# Altium project Assignment2.PrjPcb (part 1 of 2)
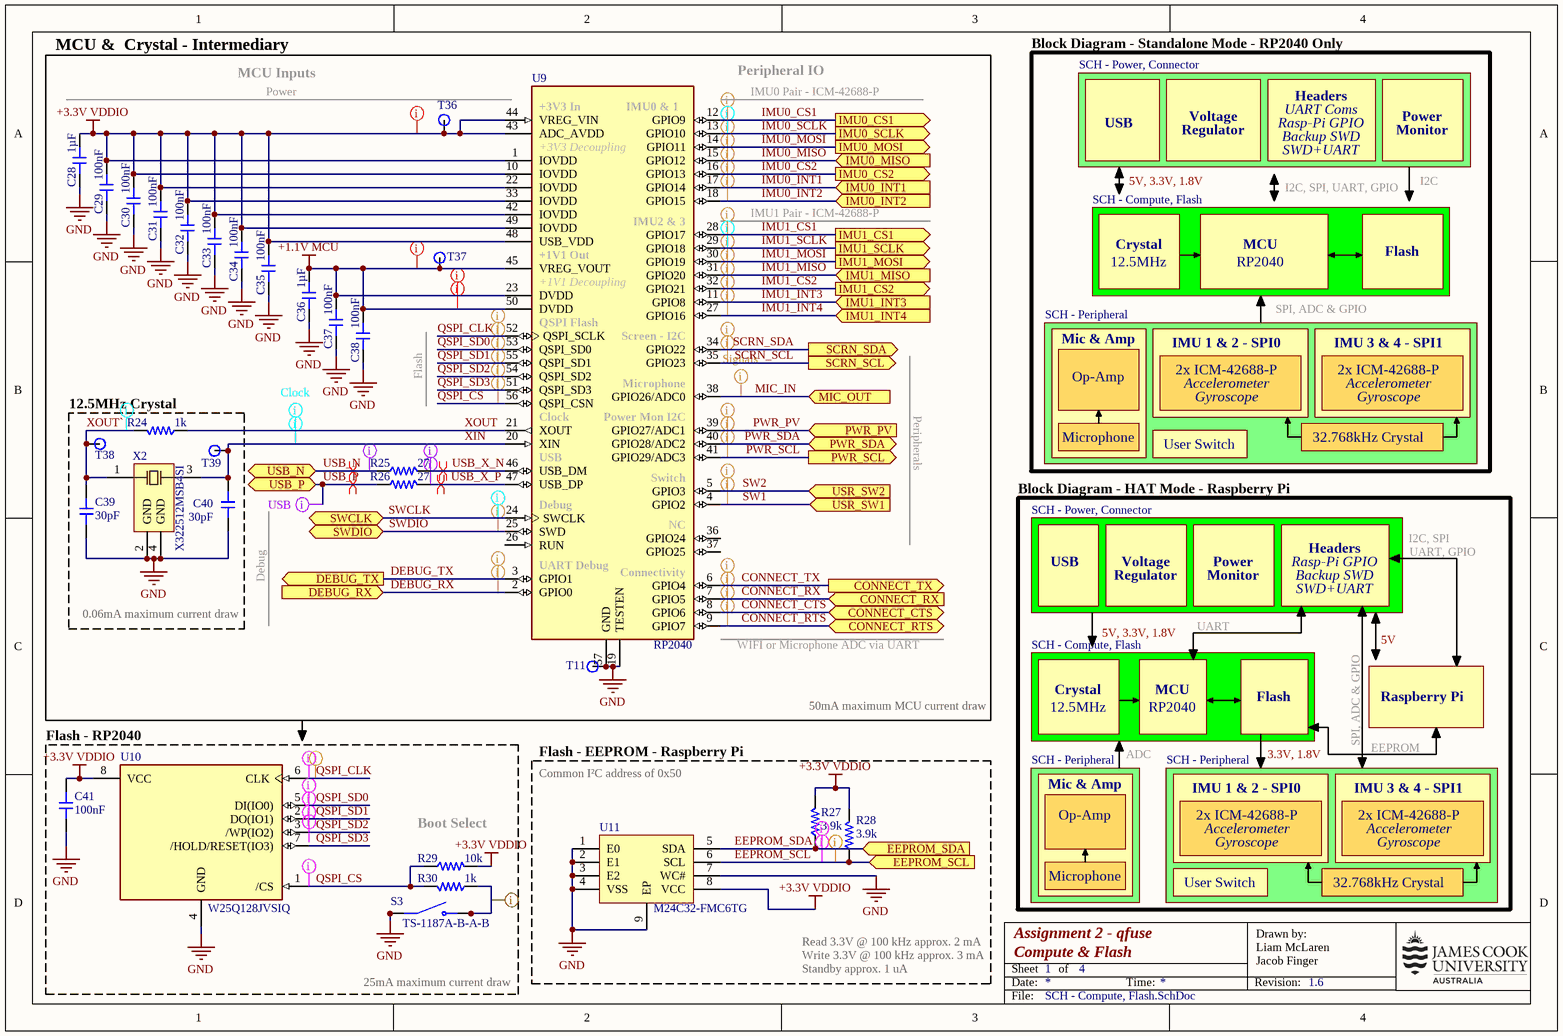
[diagram p0: SCH - Compute, Flash.SchDoc]
4 sheets, 266 parts. Net scope: flat (ports and power ports of the same name join across sheets).
Board file: qfuse_PCB.PcbDoc
Sheets:
  SCH - Compute, Flash.SchDoc
    Designator = SCH - Power, Connector.SchDoc
    Designator = SCH - Peripheral.SchDoc
    Designator = SCH - Peripheral.SchDoc
    Designator = SCH - Peripheral.SchDoc
  SCH - Wireless Coms.SchDoc

## Sheet SCH - Compute, Flash.SchDoc
size A4; CompanyName: James Cook University; DrawnBy1: Liam McLaren; Organization: James Cook University; Title1: Assignment 2 - qfuse; Revision: 1.6; SheetNumber: 1; SheetTotal: 4; Title2: Compute & Flash; DrawnBy2: Jacob Finger; ProjectName: *ProjectName

### Parts
C28  value 1µF  [CAP-0402]  (hidden comment: CL05A105KA5NQNC)
C29  value 100nF  [CAP-0402]  (hidden comment: CL05B104KB54PNC)
C30  value 100nF  [CAP-0402]  (hidden comment: CL05B104KB54PNC)
C31  value 100nF  [CAP-0402]  (hidden comment: CL05B104KB54PNC)
C32  value 100nF  [CAP-0402]  (hidden comment: CL05B104KB54PNC)
C33  value 100nF  [CAP-0402]  (hidden comment: CL05B104KB54PNC)
C34  value 100nF  [CAP-0402]  (hidden comment: CL05B104KB54PNC)
C35  value 100nF  [CAP-0402]  (hidden comment: CL05B104KB54PNC)
C36  value 1µF  [CAP-0402]  (hidden comment: CL05A105KA5NQNC)
C37  value 100nF  [CAP-0402]  (hidden comment: CL05B104KB54PNC)
C38  value 100nF  [CAP-0402]  (hidden comment: CL05B104KB54PNC)
C39  value 30pF  [CAP-0603]  (hidden comment: 0603CG300J500NT)
C40  value 30pF  [CAP-0603]  (hidden comment: 0603CG300J500NT)
C41  value 100nF  [CAP-0402]  (hidden comment: CL05B104KB54PNC)
R24  value 1k  [RES-0402]  (hidden comment: 0402WGF1001TCE)
R25  value 27  [RES-0603]  (hidden comment: 0603WAF270JT5E)
R26  value 27  [RES-0603]  (hidden comment: 0603WAF270JT5E)
R27  value 3.9k  [RES-0402]  (hidden comment: 0402WGF3901TCE)
R28  value 3.9k  [RES-0402]  (hidden comment: 0402WGF3901TCE)
R29  value 10k  [RES-0402]  (hidden comment: 0402WGF1002TCE)
R30  value 1k  [RES-0402]  (hidden comment: 0402WGF1001TCE)
S3  TS-1187A-B-A-B  [SW_TS-1187A-B-A-B]
T11  TP  [TestPoint]  (value not drawn)  (no BOM)
T36  TP  [TestPoint]  (value not drawn)  (no BOM)
T37  TP  [TestPoint]  (value not drawn)  (no BOM)
T38  TP  [TestPoint]  (value not drawn)  (no BOM)
T39  TP  [TestPoint]  (value not drawn)  (no BOM)
U9  RP2040  [QFN40P700X700X90-57N]
U10  W25Q128JVSIQ  [SOIC127P790X216-8N]
U11  M24C32-FMC6TG  [M24C32-FMC6TG]
X2  X322512MSB4SI  [X322512MSB4SI-Footprint-1]

### Blocks framed on the sheet
MCU &  Crystal - Intermediary: C28-C38 R25 R26 T11 T36 T37 U9
12.5MHz Crystal: C39 C40 R24 T38 T39 X2
Flash - EEPROM - Raspberry Pi: R27 R28 U11

### Sub-sheets
Designator = SCH - Power, Connector: no entries
Designator = SCH - Peripheral: no entries
Designator = SCH - Peripheral: no entries
Designator = SCH - Peripheral: no entries

### Ports
CONNECT_CTS (bidir, see SCH - Power, Connector[4A]), CONNECT_RTS (bidir, see SCH - Power, Connector[4B]), CONNECT_RX (in, see SCH - Power, Connector[4A], SCH - Wireless Coms[3B]), CONNECT_TX (out, see SCH - Power, Connector[4A], SCH - Wireless Coms[3B]), DEBUG_RX (in, see SCH - Power, Connector[2A]), DEBUG_TX (out, see SCH - Power, Connector[2A]), EEPROM_SCL (in, see SCH - Power, Connector[4B]), EEPROM_SDA (in, see SCH - Power, Connector[3B]), IMU0_CS1 (out, see SCH - Peripheral[2A], SCH - Power, Connector[4B]), IMU0_CS2 (out, see SCH - Peripheral[2B], SCH - Power, Connector[4B]), IMU0_INT1 (in, see SCH - Peripheral[1A], SCH - Power, Connector[4B]), IMU0_INT2 (in, see SCH - Peripheral[1B], SCH - Power, Connector[4A]), IMU0_MISO (in, see SCH - Peripheral[2A], SCH - Power, Connector[3B]), IMU0_MOSI (out, see SCH - Peripheral[2A], SCH - Power, Connector[3A]), IMU0_SCLK (out, see SCH - Peripheral[2A], SCH - Power, Connector[3B]), IMU1_CS1 (out, see SCH - Peripheral[4A], SCH - Power, Connector[4A]), IMU1_CS2 (out, see SCH - Peripheral[4B], SCH - Power, Connector[3A]), IMU1_INT3 (in, see SCH - Peripheral[3A], SCH - Power, Connector[4B]), IMU1_INT4 (in, see SCH - Peripheral[3B], SCH - Power, Connector[3B]), IMU1_MISO (in, see SCH - Peripheral[4A], SCH - Power, Connector[3B]), IMU1_MOSI (out, see SCH - Peripheral[4A], SCH - Power, Connector[4B]), IMU1_SCLK (out, see SCH - Peripheral[4A], SCH - Power, Connector[4B]), MIC_OUT (in, see SCH - Peripheral[2D]), PWR_PV (in, see SCH - Power, Connector[3A], SCH - Power, Connector[4C]), PWR_SCL (out, see SCH - Power, Connector[3A], SCH - Power, Connector[4C]), PWR_SDA (bidir, see SCH - Power, Connector[3A], SCH - Power, Connector[4C]), SCRN_SCL (out, see SCH - Power, Connector[2B], SCH - Power, Connector[3A]), SCRN_SDA (out, see SCH - Power, Connector[2B], SCH - Power, Connector[3A]), SWCLK (bidir, see SCH - Power, Connector[1B], SCH - Power, Connector[2A]), SWDIO (bidir, see SCH - Power, Connector[1B], SCH - Power, Connector[2A]), USB_N (bidir, see SCH - Power, Connector[1A]), USB_P (bidir, see SCH - Power, Connector[1A]), USR_SW1 (in, see SCH - Peripheral[3C], SCH - Power, Connector[3B]), USR_SW2 (in, see SCH - Peripheral[3D], SCH - Power, Connector[3B])

### Nets
+1.1V MCU: C36.1 C37.2 C38.2 T37.1(TP) U9.23(DVDD) U9.45(VREG_VOUT) U9.50(DVDD)
+3.3V VDDIO: C28.2 C29.2 C30.2 C31.2 C32.2 C33.2 C34.2 C35.2 C41.2 R27.2 R28.2 R29.2 T36.1(TP) U9.1(IOVDD) U9.10(IOVDD) U9.22(IOVDD) U9.33(IOVDD) U9.42(IOVDD) U9.43(ADC_AVDD) U9.44(VREG_VIN) U9.48(USB_VDD) U9.49(IOVDD) U10.8(VCC) U11.8(VCC)
GND: C28.1 C29.1 C30.1 C31.1 C32.1 C33.1 C34.1 C35.1 C36.2 C37.1 C38.1 C39.1 C40.1 C41.1 S3.A(COM) S3.B(COM) T11.1(TP) U9.19(TESTEN) U9.57(GND) U10.4(GND) U11.1(E0) U11.2(E1) U11.3(E2) U11.4(VSS) U11.7(WC#) U11.9(EP) X2.2(GND) X2.4(GND)
CONNECT_CTS: U9.8(GPIO6) ; port CONNECT_CTS
CONNECT_RTS: U9.9(GPIO7) ; port CONNECT_RTS
CONNECT_RX: U9.7(GPIO5) ; port CONNECT_RX
CONNECT_TX: U9.6(GPIO4) ; port CONNECT_TX
DEBUG_RX: U9.2(GPIO0) ; port DEBUG_RX
DEBUG_TX: U9.3(GPIO1) ; port DEBUG_TX
EEPROM_SCL: R28.1 U11.6(SCL) ; port EEPROM_SCL
EEPROM_SDA: R27.1 U11.5(SDA) ; port EEPROM_SDA
IMU0_CS1: U9.12(GPIO9) ; port IMU0_CS1
IMU0_CS2: U9.16(GPIO13) ; port IMU0_CS2
IMU0_INT1: U9.17(GPIO14) ; port IMU0_INT1
IMU0_INT2: U9.18(GPIO15) ; port IMU0_INT2
IMU0_MISO: U9.15(GPIO12) ; port IMU0_MISO
IMU0_MOSI: U9.14(GPIO11) ; port IMU0_MOSI
IMU0_SCLK: U9.13(GPIO10) ; port IMU0_SCLK
IMU1_CS1: U9.28(GPIO17) ; port IMU1_CS1
IMU1_CS2: U9.32(GPIO21) ; port IMU1_CS2
IMU1_INT3: U9.11(GPIO8) ; port IMU1_INT3
IMU1_INT4: U9.27(GPIO16) ; port IMU1_INT4
IMU1_MISO: U9.31(GPIO20) ; port IMU1_MISO
IMU1_MOSI: U9.30(GPIO19) ; port IMU1_MOSI
IMU1_SCLK: U9.29(GPIO18) ; port IMU1_SCLK
MIC_IN: U9.38(GPIO26/ADC0) ; port MIC_OUT
PWR_PV: U9.39(GPIO27/ADC1) ; port PWR_PV
PWR_SCL: U9.41(GPIO29/ADC3) ; port PWR_SCL  [project net I2C_SCL]
PWR_SDA: U9.40(GPIO28/ADC2) ; port PWR_SDA  [project net I2C_SDA]
QSPI_CLK: U9.52(QSPI_SCLK) U10.6(CLK)
QSPI_CS: R29.1 R30.2 U9.56(QSPI_CSN) U10.1(/CS)
QSPI_SD0: U9.53(QSPI_SD0) U10.5(DI(IO0))
QSPI_SD1: U9.55(QSPI_SD1) U10.2(DO(IO1))
QSPI_SD2: U9.54(QSPI_SD2) U10.3(/WP(IO2))
QSPI_SD3: U9.51(QSPI_SD3) U10.7(/HOLD/RESET(IO3))
SCRN_SCL: U9.35(GPIO23) ; port SCRN_SCL  [project net SCREEN_SCL]
SCRN_SDA: U9.34(GPIO22) ; port SCRN_SDA  [project net SCREEN_SDA]
SW1: U9.4(GPIO2) ; port USR_SW1
SW2: U9.5(GPIO3) ; port USR_SW2
SWCLK: U9.24(SWCLK) ; port SWCLK
SWDIO: U9.25(SWD) ; port SWDIO
USB_N: R25.1 ; port USB_N
USB_P: R26.1 ; port USB_P
USB_X_N: R25.2 U9.46(USB_DM)
USB_X_P: R26.2 U9.47(USB_DP)
XIN: C40.2 T39.1(TP) U9.20(XIN) X2.3(OSC2)
XOUT: R24.1 U9.21(XOUT)
XOUT`: C39.2 R24.2 T38.1(TP) X2.1(OSC1)
NetR30_1: R30.1 S3.C(NO) S3.D(NO)

Not connected (* = marked no-connect by the designer): U9 26(RUN) 36(GPIO24) 37(GPIO25)

### Layout directives
differential pair: USB_N, USB_P, USB_X_N, USB_X_P
net class Power: +1.1V MCU, +3.3V VDDIO
net class Signals: (no net found under the mark), CONNECT_CTS, CONNECT_RTS, CONNECT_RX, CONNECT_TX, DEBUG_RX, DEBUG_TX, EEPROM_SCL, EEPROM_SDA, I2C_SCL, I2C_SDA, IMU0_CS1, IMU0_CS2, IMU0_INT1, IMU0_INT2, IMU0_MISO, IMU0_MOSI, IMU1_CS1, IMU1_CS2, IMU1_INT3, IMU1_INT4, IMU1_MISO, IMU1_MOSI, MIC_IN, PWR_PV, QSPI_CLK, QSPI_CS, QSPI_SD0, QSPI_SD1, QSPI_SD2, SCREEN_SCL, SCREEN_SDA, SW1, SW2, SWDIO
net class QSPI: QSPI_CLK, QSPI_CS, QSPI_SD0, QSPI_SD1, QSPI_SD2, QSPI_SD3
net class Clock: EEPROM_SCL, IMU0_SCLK, IMU1_SCLK, QSPI_CLK, SWCLK, XIN, XOUT, XOUT`
net class USB: USB_N, USB_P, USB_X_N, USB_X_P
net class GND: NetR30_1

### Notes on the sheet
- MCU Inputs
- Power
- Peripheral IO
- IMU0 Pair - ICM-42688-P
- Block Diagram - Standalone Mode - RP2040 Only
- USB
- Voltage
- Regulator
- Headers
- Rasp-Pi GPIO
- UART Coms
- Monitor
- 5V, 3.3V, 1.8V
- Backup SWD
- SWD+UART
- I2C
- (near U9) IMU1 Pair - ICM-42688-P
- SCH - Compute, Flash
- Crystal
- MCU
- I2C, SPI, UART, GPIO
- Flash
- 12.5MHz
- RP2040
- SPI, ADC & GPIO
- Op-Amp
- Mic & Amp
- IMU 1 & 2 - SPI0
- Accelerometer
- 2x ICM-42688-P
- IMU 3 & 4 - SPI1
- Peripherals
- Microphone
- User Switch
- Gyroscope
- 32.768kHz Crystal
- Block Diagram - HAT Mode - Raspberry Pi
- SCH - Power, Connector
- (near C40) Debug
- I2C, SPI
- UART, GPIO
- 0.06mA maximum current draw
- (near U9) WIFI or Microphone ADC via UART
- UART
- 5V
- 50mA maximum MCU current draw
- Raspberry Pi
- Flash - RP2040
- Common I²C address of 0x50
- ADC
- 3.3V, 1.8V
- EEPROM
- Boot Select
- 25mA maximum current draw
- Read 3.3V @ 100 kHz approx. 2 mA
- Write 3.3V @ 100 kHz approx. 3 mA
- Standby approx. 1 uA
- Date:
- Sheet
- of
- Time:
- Revision:
- Drawn by:
- File:
- (in symbol CMP-043-000000-5) +3V3 In; IMU0 & 1; +3V3 Decoupling; IMU2 & 3; +1V1 Out; +1V1 Decoupling; QSPI Flash; Screen - I2C; Microphone; Clock; Power Mon I2C; USB; Switch; Debug; NC; UART Debug; Connectivity

### Library data of the parts
C28 C36 = CMP-001-00140-3: Capacitor, Ceramic (MLCC), 1uF, ±10%, 25V, X5R, ±10%, SMD 0402; Manufacturer: Samsung Electro-Mechanics; Case/Package: 0402; JLCPCB Basic Part: Yes; ComponentLink2URL: https://jlcpcb.com/partdetail/C52923; Source: jlcpcb_capacitors_basic.schlib; ComponentLink1URL: https://datasheet.lcsc.com/lcsc/1811091611_Samsung-Electro-Mechanics-CL05A105KA5NQNC_C52923.pdf; RoHS: Yes; ComponentLink2Description: JLCPCB Part URL; Temperature Coefficient: X5R; ComponentLink3Description: LCSC Part URL; Category: Capacitors - MLCC; Voltage Rating: 25V; Tolerance: 10%; Design Item ID: CL05A105KA5NQNC; ComponentLink3URL: https://lcsc.com/product-detail/Multilayer-Ceramic-Capacitors-MLCC---SMD-SMT_Samsung-Electro-Mechanics-Samsung-Electro-Mechanics-CL05A105KA5NQNC_C52923.html; Manufacturer Part Number: CL05A105KA5NQNC; JLCPCB Part Number: C52923; ComponentLink1Description: Datasheet
C29-C35 C37 C38 C41 = CMP-001-00146-3: Capacitor, Ceramic (MLCC), 100nF, ±10%, 50V, X7R, ±10%, SMD 0402; Manufacturer: Samsung Electro-Mechanics; Design Item ID: CL05B104KB54PNC; Source: jlcpcb_capacitors_basic.schlib; Case/Package: 0402; Temperature Coefficient: X7R; ComponentLink3URL: https://lcsc.com/product-detail/Multilayer-Ceramic-Capacitors-MLCC---SMD-SMT_Samsung-Electro-Mechanics-Samsung-Electro-Mechanics-CL05B104KB54PNC_C307331.html; Manufacturer Part Number: CL05B104KB54PNC; RoHS: Yes; ComponentLink1Description: Datasheet; Voltage Rating: 50V; ComponentLink2Description: JLCPCB Part URL; JLCPCB Basic Part: Yes; Category: Capacitors - MLCC; ComponentLink3Description: LCSC Part URL; ComponentLink2URL: https://jlcpcb.com/partdetail/C307331; JLCPCB Part Number: C307331; Tolerance: 10%; ComponentLink1URL: https://datasheet.lcsc.com/lcsc/1810191222_Samsung-Electro-Mechanics-CL05B104KB54PNC_C307331.pdf
C39 C40 = CMP-001-00132-2: Capacitor, Ceramic (MLCC), 30pF, ±5%, 50V, C0G, ±5%, SMD 0603; Manufacturer: FH(Guangdong Fenghua Advanced Tech); Voltage Rating: 50V; ComponentLink3URL: https://lcsc.com/product-detail/Multilayer-Ceramic-Capacitors-MLCC---SMD-SMT_FH-Guangdong-Fenghua-Advanced-Tech-FH-Guangdong-Fenghua-Advanced-Tech-0603CG300J500NT_C1658.html; JLCPCB Part Number: C1658; ComponentLink3Description: LCSC Part URL; Tolerance: 5%; ComponentLink2Description: JLCPCB Part URL; Category: Capacitors - MLCC; ComponentLink2URL: https://jlcpcb.com/partdetail/C1658; JLCPCB Basic Part: Yes; Source: jlcpcb_capacitors_basic.schlib; Temperature Coefficient: C0G; Case/Package: 0603; ComponentLink1URL: https://datasheet.lcsc.com/lcsc/1810261611_FH--Guangdong-Fenghua-Advanced-Tech-0603CG300J500NT_C1658.pdf; ComponentLink1Description: Datasheet; Design Item ID: 0603CG300J500NT; RoHS: Yes; Manufacturer Part Number: 0603CG300J500NT
R24 R30 = CMP-009-00180-4: Resistor, 1kΩ, ±1%, 62.5mW, 50V, ±100ppm/℃, -55℃~+155℃, SMD 0402; Manufacturer: Uniroyal; Temperature Coefficient: ±100ppm/℃; JLCPCB Part Number: C11702; ComponentLink2URL: https://jlcpcb.com/partdetail/C11702; Power Rating: 62.5mW; JLCPCB Basic Part: Yes; ComponentLink2Description: JLCPCB Part URL; ComponentLink1URL: https://datasheet.lcsc.com/lcsc/2206010216_UNI-ROYAL-Uniroyal-Elec-0402WGF1001TCE_C11702.pdf; Temperature Rating: -55℃~+155℃; Manufacturer Part Number: 0402WGF1001TCE; ComponentLink1Description: Datasheet; Tolerance: 1%; Source: jlcpcb_resistors_basic.schlib; Design Item ID: 0402WGF1001TCE; Case/Package: 0402; Voltage Rating: 50V; Category: Resistors
R25 R26 = CMP-009-00289-2: Resistor, 27Ω, ±1%, 100mW, 75V, ±200ppm/℃, -55℃~+155℃, SMD 0603; Manufacturer: Uniroyal; Design Item ID: 0603WAF270JT5E; Temperature Coefficient: ±200ppm/℃; ComponentLink1URL: https://datasheet.lcsc.com/lcsc/2205311845_UNI-ROYAL-Uniroyal-Elec-0603WAF270JT5E_C25190.pdf; ComponentLink2URL: https://jlcpcb.com/partdetail/C25190; Power Rating: 100mW; JLCPCB Part Number: C25190; Manufacturer Part Number: 0603WAF270JT5E; Source: jlcpcb_resistors_basic.schlib; Voltage Rating: 75V; Tolerance: 1%; Case/Package: 0603; Temperature Rating: -55℃~+155℃; ComponentLink1Description: Datasheet; Category: Resistors; ComponentLink2Description: JLCPCB Part URL; JLCPCB Basic Part: Yes
R27 R28 = CMP-009-00215-4: Resistor, 3.9kΩ, ±1%, 62.5mW, 50V, ±100ppm/℃, -55℃~+155℃, SMD 0402; Manufacturer: Uniroyal; ComponentLink2URL: https://jlcpcb.com/partdetail/C51721; Manufacturer Part Number: 0402WGF3901TCE; ComponentLink1Description: Datasheet; Tolerance: 1%; JLCPCB Basic Part: Yes; Category: Resistors; Voltage Rating: 50V; Case/Package: 0402; Source: jlcpcb_resistors_basic.schlib; Design Item ID: 0402WGF3901TCE; Temperature Rating: -55℃~+155℃; JLCPCB Part Number: C51721; Power Rating: 62.5mW; ComponentLink1URL: https://datasheet.lcsc.com/lcsc/2206010000_UNI-ROYAL-Uniroyal-Elec-0402WGF3901TCE_C51721.pdf; ComponentLink2Description: JLCPCB Part URL; Temperature Coefficient: ±100ppm/℃
R29 = CMP-009-00181-4: Resistor, 10kΩ, ±1%, 62.5mW, 50V, ±100ppm/℃, -55℃~+155℃, SMD 0402; Manufacturer: Uniroyal; ComponentLink1Description: Datasheet; JLCPCB Basic Part: Yes; Temperature Rating: -55℃~+155℃; Power Rating: 62.5mW; ComponentLink2URL: https://jlcpcb.com/partdetail/C25744; ComponentLink2Description: JLCPCB Part URL; Case/Package: 0402; Voltage Rating: 50V; ComponentLink1URL: https://datasheet.lcsc.com/lcsc/2206010100_UNI-ROYAL-Uniroyal-Elec-0402WGF1002TCE_C25744.pdf; Source: jlcpcb_resistors_basic.schlib; Category: Resistors; Design Item ID: 0402WGF1002TCE; Temperature Coefficient: ±100ppm/℃; JLCPCB Part Number: C25744; Tolerance: 1%; Manufacturer Part Number: 0402WGF1002TCE
S3 = CMP-051-000000-5: SPST 50mA @ 12VDC Top Actuated Round Button 160gf SMD Tactile Switches RoHS; Availability: Unavailable; Value: *; Price: None; Design Item ID: TS-1187A-B-A-B; Component Type: Standard; Pin Count: 4; Source: TS-1187A-B-A-B.SchLib; MP: TS-1187A-B-A-B; Package: None; JLCPCB Part Number: C318884
T11 T36-T39 = TestPoint
U9 = CMP-043-000000-5: ARM Cortex-M0+ MCU 32-Bit Microcontroller for Raspberry Pi Pico; Package: None; Price: None; Availability: Available; Design Item ID: RP2040; Component Type: Standard; Pin Count: 57; Source: RP2040.SchLib; Value: *; MP: RP2040; JLCPCB Part Number: C2040
U10 = CMP-031-00006-4: FLASH - NOR Memory IC 128Mb (16M x 8) SPI - Quad I/O, QPI, DTR 133 MHz 8-SOIC; MF: Winbond Electronics; Pin Count: 8; Check_prices: https://www.snapeda.com/parts/W25Q128JVSIQ/Winbond+Electronics/view-part/?ref=eda; Package: SOIC-8 Winbond; MP: W25Q128JVSIQ; Component Type: Standard; Source: W25Q128JVSIQ.SchLib; Design Item ID: W25Q128JVSIQ; Purchase-URL: https://pricing.snapeda.com/search/part/W25Q128JVSIQ/?ref=eda; Price: None; Availability: In Stock; SnapEDA_Link: https://www.snapeda.com/parts/W25Q128JVSIQ/Winbond+Electronics/view-part/?ref=snap; Value: *; JLCPCB Part Number: C97521
U11 = M24C32-FMC6TG: STMicroelectronics M24C32-FMC6TG - UFDFPN-8(2x3) - 32Kbit I2C UFDFPN-8(2x3) EEPROM ROHS; JLCPCB Part Number: C2060985
X2 = CMP-00002-4: 12MHz SMD Crystal Resonator 20pF ±10ppm ±30ppm -40℃~+85℃ SMD3225-4P  Crystals ROHS Yangxing Tech; Max ESR: 80 Ω; Load capacitance: 20 pF; Frequency: 12 MHz; JLCPCB Part Number: C9002

## Sheet SCH - Power, Connector.SchDoc
size A4; CompanyName: James Cook University; DrawnBy1: Liam McLaren; Organization: James Cook University; Title1: Assignment 2 - qfuse; Revision: 1.6; SheetNumber: 2; SheetTotal: 4; Title2: Power & Connection; DrawnBy2: Jacob Finger; ProjectName: *ProjectName
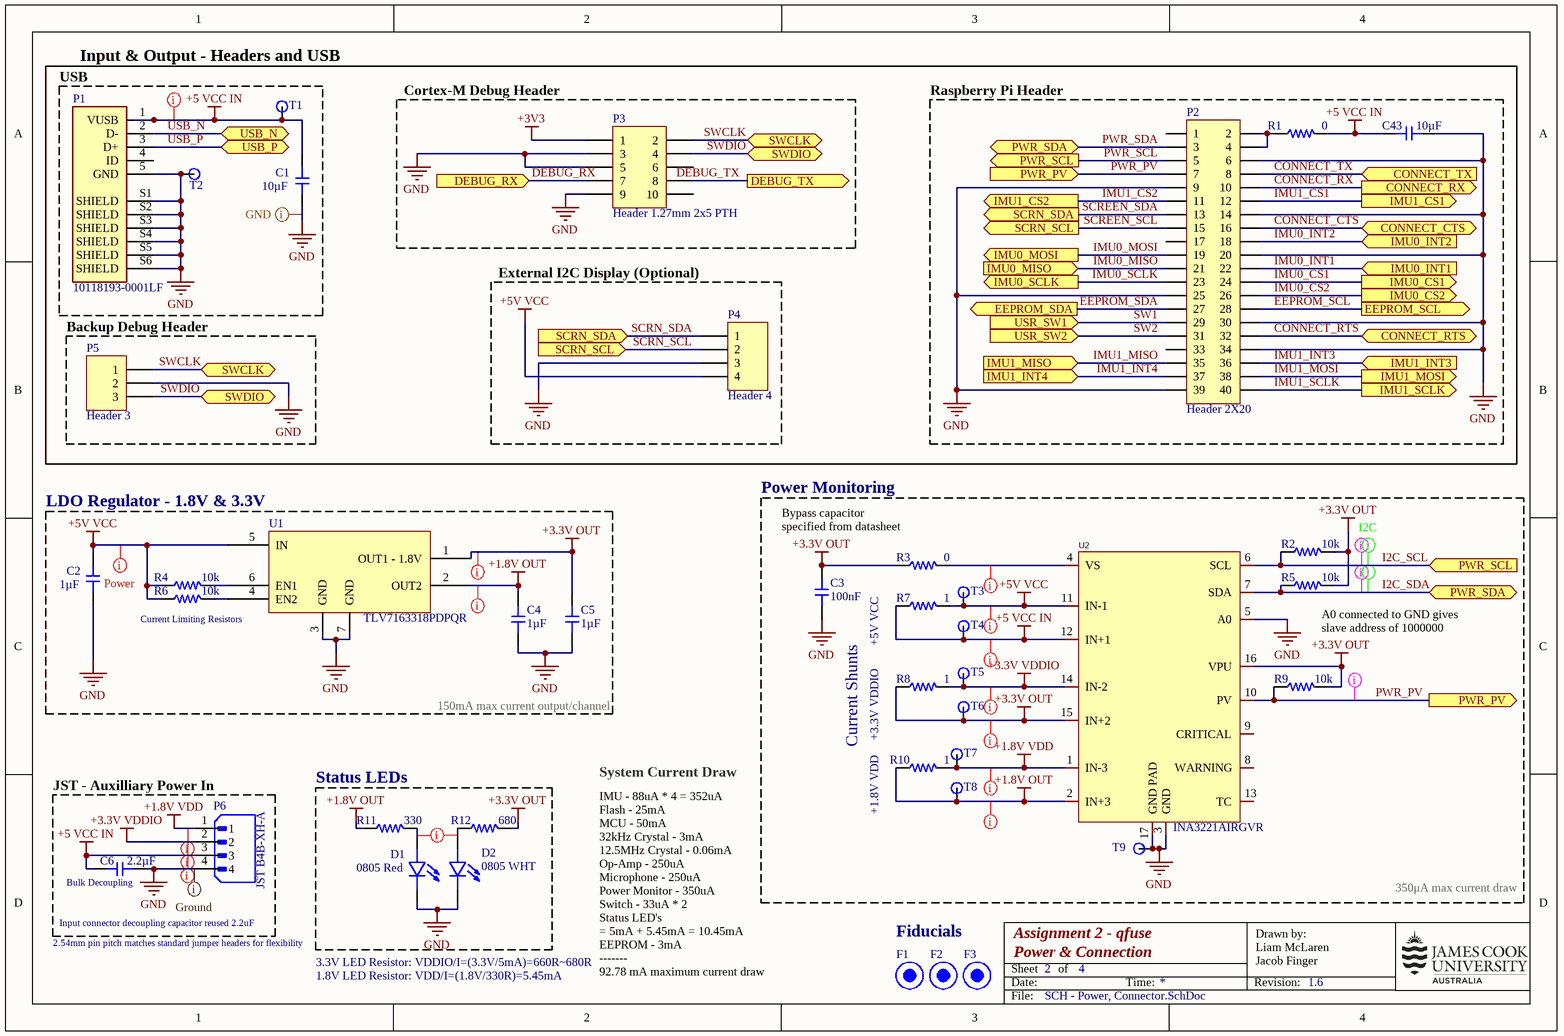
[diagram p1: SCH - Power, Connector.SchDoc]

### Parts
C1  value 10µF  [CAP-0402]  (hidden comment: CL05A106MQ5NUNC)
C2  value 1µF  [CAP-0402]  (hidden comment: CL05A105KA5NQNC)
C3  value 100nF  [CAP-0402]  (hidden comment: CL05B104KB54PNC)
C4  value 1µF  [CAP-0402]  (hidden comment: CL05A105KA5NQNC)
C5  value 1µF  [CAP-0402]  (hidden comment: CL05A105KA5NQNC)
C6  value 2.2µF  [CAP-0402]  (hidden comment: CL05A225MQ5NSNC)
C43  value 10µF  [CAP-0402]  (hidden comment: CL05A106MQ5NUNC)
D1  0805 Red  [NCD0805R1]
D2  0805 WHT  [LED_KT-0805G]
F1  Fiducial Pad  [Fiducial]  (value not drawn)
F2  Fiducial Pad  [Fiducial]  (value not drawn)
F3  Fiducial Pad  [Fiducial]  (value not drawn)
P1  10118193-0001LF  [FCI_10118193-0001LF]
P2  Header 2X20  [HDR2X20]  (no BOM)
P3  Header 1.27mm 2x5 PTH  [Header 1.27mm 2x5 PTH]  (no BOM)
P4  Header 4  [HDR1X4]  (no BOM)
P5  Header 3  [HDR1X3]  (no BOM)
P6  JST B4B-XH-A  [JST_B4B-XH-A]  (no BOM)
R1  value 0  [RES-0402]  (hidden comment: 0402WGF0000TCE)
R2  value 10k  [RES-0402]  (hidden comment: 0402WGF1002TCE)
R3  value 0  [RES-0402]  (hidden comment: 0402WGF0000TCE)
R4  value 10k  [RES-0402]  (hidden comment: 0402WGF1002TCE)
R5  value 10k  [RES-0402]  (hidden comment: 0402WGF1002TCE)
R6  value 10k  [RES-0402]  (hidden comment: 0402WGF1002TCE)
R7  value 1  [RES-0402]  (hidden comment: 0402WGF100KTCE)
R8  value 1  [RES-0402]  (hidden comment: 0402WGF100KTCE)
R9  value 10k  [RES-0402]  (hidden comment: 0402WGF1002TCE)
R10  value 1  [RES-0402]  (hidden comment: 0402WGF100KTCE)
R11  value 330  [RES-0402]  (hidden comment: 0402WGF3300TCE)
R12  value 680  [RES-0402]  (hidden comment: 0402WGF6800TCE)
T1  TP  [TestPoint]  (value not drawn)  (no BOM)
T2  TP  [TestPoint]  (value not drawn)  (no BOM)
T3  TP  [TestPoint]  (value not drawn)  (no BOM)
T4  TP  [TestPoint]  (value not drawn)  (no BOM)
T5  TP  [TestPoint]  (value not drawn)  (no BOM)
T6  TP  [TestPoint]  (value not drawn)  (no BOM)
T7  TP  [TestPoint]  (value not drawn)  (no BOM)
T8  TP  [TestPoint]  (value not drawn)  (no BOM)
T9  TP  [TestPoint]  (value not drawn)  (no BOM)
U1  TLV7163318PDPQR  [XDFN-6_L1.2-W1.2-P0.40-BL-EP]
U2  INA3221AIRGVR  [QFN-16_L4.0-W4.0-P0.65-TL-EP2.2]

### Blocks framed on the sheet
USB: C1 P1 T1 T2
Cortex-M Debug Header: P3
Raspberry Pi Header: C43 P2 R1
External I2C Display (Optional): P4
Backup Debug Header: P5
LDO Regulator - 1.8V & 3.3V: C2 C4 C5 R4 R6 U1
JST - Auxilliary Power In: C6 P6
Status LEDs: D1 D2 R11 R12

### Ports
CONNECT_CTS (bidir, see SCH - Compute, Flash[3C]), CONNECT_RTS (bidir, see SCH - Compute, Flash[3C]), CONNECT_RX (out, see SCH - Compute, Flash[3C], SCH - Wireless Coms[3B]), CONNECT_TX (in, see SCH - Compute, Flash[3C], SCH - Wireless Coms[3B]), DEBUG_RX (in, see SCH - Compute, Flash[1C]), DEBUG_TX (out, see SCH - Compute, Flash[1C]), EEPROM_SCL (out, see SCH - Compute, Flash[3D]), EEPROM_SDA (out, see SCH - Compute, Flash[3D]), IMU0_CS1 (out, see SCH - Compute, Flash[3A], SCH - Peripheral[2A]), IMU0_CS2 (out, see SCH - Compute, Flash[3A], SCH - Peripheral[2B]), IMU0_INT1 (in, see SCH - Compute, Flash[3A], SCH - Peripheral[1A]), IMU0_INT2 (in, see SCH - Compute, Flash[3A], SCH - Peripheral[1B]), IMU0_MISO (in, see SCH - Compute, Flash[3A], SCH - Peripheral[2A]), IMU0_MOSI (out, see SCH - Compute, Flash[3A], SCH - Peripheral[2A]), IMU0_SCLK (out, see SCH - Compute, Flash[3A], SCH - Peripheral[2A]), IMU1_CS1 (out, see SCH - Compute, Flash[3A], SCH - Peripheral[4A]), IMU1_CS2 (out, see SCH - Compute, Flash[3B], SCH - Peripheral[4B]), IMU1_INT3 (in, see SCH - Compute, Flash[3B], SCH - Peripheral[3A]), IMU1_INT4 (in, see SCH - Compute, Flash[3B], SCH - Peripheral[3B]), IMU1_MISO (in, see SCH - Compute, Flash[3B], SCH - Peripheral[4A]), IMU1_MOSI (out, see SCH - Compute, Flash[3B], SCH - Peripheral[4A]), IMU1_SCLK (out, see SCH - Compute, Flash[3A], SCH - Peripheral[4A]), PWR_PV (in, see SCH - Compute, Flash[3B], SCH - Power, Connector[4C]), PWR_PV (out, see SCH - Compute, Flash[3B], SCH - Power, Connector[3A]), PWR_SCL (in, see SCH - Compute, Flash[3B], SCH - Power, Connector[3A]), PWR_SCL (out, see SCH - Compute, Flash[3B], SCH - Power, Connector[4C]), PWR_SDA (bidir, see SCH - Compute, Flash[3B], SCH - Power, Connector[3A]), PWR_SDA (bidir, see SCH - Compute, Flash[3B], SCH - Power, Connector[4C]), SCRN_SCL (in, see SCH - Compute, Flash[3B], SCH - Power, Connector[3A]), SCRN_SCL (out, see SCH - Compute, Flash[3B], SCH - Power, Connector[2B]), SCRN_SDA (in, see SCH - Compute, Flash[3B], SCH - Power, Connector[3A]), SCRN_SDA (out, see SCH - Compute, Flash[3B], SCH - Power, Connector[2B]), SWCLK (bidir, see SCH - Compute, Flash[1C], SCH - Power, Connector[1B]), SWCLK (bidir, see SCH - Compute, Flash[1C], SCH - Power, Connector[2A]), SWDIO (bidir, see SCH - Compute, Flash[1C], SCH - Power, Connector[1B]), SWDIO (bidir, see SCH - Compute, Flash[1C], SCH - Power, Connector[2A]), USB_N (bidir, see SCH - Compute, Flash[1B]), USB_P (bidir, see SCH - Compute, Flash[1B]), USR_SW1 (in, see SCH - Compute, Flash[3B], SCH - Peripheral[3C]), USR_SW2 (in, see SCH - Compute, Flash[3B], SCH - Peripheral[3D])

### Nets
+1.8V OUT: C4.2 R10.1 R11.1 T8.1(TP) U1.2(OUT2) U2.2(IN+3)
+1.8V VDD: P6.1 R10.2 T7.1(TP) U2.1(IN-3)
+3.3V OUT: C3.2 C5.2 R2.2 R3.1 R5.2 R8.1 R9.2 R12.2 T6.1(TP) U1.1(OUT1_-_1.8V) U2.15(IN+2) U2.16(VPU)
+3.3V VDDIO: P6.2 R8.2 T5.1(TP) U2.14(IN-2)
+3V3: P3.1
+5 VCC IN: C1.2 C6.2 C43.2 P1.1(VUSB) P6.3 R1.2 R7.1 T1.1(TP) T4.1(TP) U2.12(IN+1)
+5V VCC: C2.2 P4.4 R4.1 R6.1 R7.2 T3.1(TP) U1.5(IN) U2.11(IN-1)
GND: C1.1 C2.1 C3.1 C4.1 C5.1 C6.1 C43.1 D1.C D2.C P1.5(GND) P1.S1(SHIELD) P1.S2(SHIELD) P1.S3(SHIELD) P1.S4(SHIELD) P1.S5(SHIELD) P1.S6(SHIELD) P2.6 P2.9 P2.14 P2.20 P2.25 P2.30 P2.34 P2.39 P3.3 P3.5 P3.9 P4.3 P5.2 P6.4 T2.1(TP) T9.1(TP) U1.3(GND) U1.7(GND) U2.3(GND) U2.5(A0) U2.17(GND_PAD)
CONNECT_CTS: P2.16 ; port CONNECT_CTS
CONNECT_RTS: P2.32 ; port CONNECT_RTS
CONNECT_RX: P2.10 ; port CONNECT_RX
CONNECT_TX: P2.8 ; port CONNECT_TX
DEBUG_RX: P3.7 ; port DEBUG_RX
DEBUG_TX: P3.8 ; port DEBUG_TX
EEPROM_SCL: P2.28 ; port EEPROM_SCL
EEPROM_SDA: P2.27 ; port EEPROM_SDA
I2C_SCL: P2.5 R2.1 U2.6(SCL) ; port PWR_SCL  [also labelled PWR_SCL]
I2C_SDA: P2.3 R5.1 U2.7(SDA) ; port PWR_SDA  [also labelled PWR_SDA]
IMU0_CS1: P2.24 ; port IMU0_CS1
IMU0_CS2: P2.26 ; port IMU0_CS2
IMU0_INT1: P2.22 ; port IMU0_INT1
IMU0_INT2: P2.18 ; port IMU0_INT2
IMU0_MISO: P2.21 ; port IMU0_MISO
IMU0_MOSI: P2.19 ; port IMU0_MOSI
IMU0_SCLK: P2.23 ; port IMU0_SCLK
IMU1_CS1: P2.12 ; port IMU1_CS1
IMU1_CS2: P2.11 ; port IMU1_CS2
IMU1_INT3: P2.36 ; port IMU1_INT3
IMU1_INT4: P2.37 ; port IMU1_INT4
IMU1_MISO: P2.35 ; port IMU1_MISO
IMU1_MOSI: P2.38 ; port IMU1_MOSI
IMU1_SCLK: P2.40 ; port IMU1_SCLK
PWR_PV: P2.7 R9.1 U2.10(PV) ; port PWR_PV
SCREEN_SCL: P2.15 P4.2 ; port SCRN_SCL  [also labelled SCRN_SCL]
SCREEN_SDA: P2.13 P4.1 ; port SCRN_SDA  [also labelled SCRN_SDA]
SW1: P2.29 ; port USR_SW1
SW2: P2.31 ; port USR_SW2
SWCLK: P3.2 P5.1 ; port SWCLK
SWDIO: P3.4 P5.3 ; port SWDIO
USB_N: P1.2(D-) ; port USB_N
USB_P: P1.3(D+) ; port USB_P
NetD1_A: D1.A R11.2
NetD2_A: D2.A R12.1
NetP2_2: P2.2 P2.4 R1.1
NetR3_2: R3.2 U2.4(VS)
NetR4_2: R4.2 U1.6(EN1)
NetR6_2: R6.2 U1.4(EN2)

Not connected (* = marked no-connect by the designer): P1 4(ID); P2 1 17 33; P3 6 10; U2 8(WARNING) 9(CRITICAL) 13(TC)

### Layout directives
net class Power: +1.8V OUT, +1.8V VDD, +3.3V OUT, +3.3V VDDIO, +5 VCC IN, +5V VCC, NetD1_A, NetD2_A, NetR3_2
net class Signals: I2C_SCL, I2C_SDA, PWR_PV
net class I2C: I2C_SCL, I2C_SDA
net class GND: GND
net class Ground: GND

### Notes on the sheet
- Input & Output - Headers and USB
- Power Monitoring
- Bypass capacitor specified from datasheet
- (near U1) Current Limiting Resistors
- (near R7) +5V VCC
- (near R5) A0 connected to GND gives slave address of 1000000
- 150mA max current output/channel
- System Current Draw
- Current Shunts
- +3.3V VDDIO
- (near R10) +1.8V VDD
- Input connector decoupling capacitor reused 2.2uF
- (near C6) Bulk Decoupling
- 350μA max current draw
- 2.54mm pin pitch matches standard jumper headers for flexibility
- 3.3V LED Resistor: VDDIO/I=(3.3V/5mA)=660R~680R
- 1.8V LED Resistor: VDD/I=(1.8V/330R)=5.45mA
- IMU - 88uA * 4 = 352uA
  Flash - 25mA
  MCU - 50mA
  32kHz Crystal - 3mA
  12.5MHz Crystal - 0.06mA
  Op-Amp - 250uA
  Microphone - 250uA
  Power Monitor - 350uA
  Switch - 33uA * 2
  Status LED's
  = 5mA + 5.45mA = 10.45mA
  EEPROM - 3mA
  -------
  92.78 mA maximum current draw
- Fiducials
- Date:
- Sheet
- of
- Time:
- Revision:
- Drawn by:
- File:

### Library data of the parts
C1 C43 = CMP-001-00141-3: Capacitor, Ceramic (MLCC), 10uF, ±20%, 6.3V, X5R, ±20%, SMD 0402; Manufacturer: Samsung Electro-Mechanics; JLCPCB Part Number: C15525; Tolerance: 20%; Temperature Coefficient: X5R; ComponentLink2Description: JLCPCB Part URL; ComponentLink3Description: LCSC Part URL; Voltage Rating: 6.3V; ComponentLink1Description: Datasheet; ComponentLink1URL: https://datasheet.lcsc.com/lcsc/2208231630_Samsung-Electro-Mechanics-CL05A106MQ5NUNC_C15525.pdf; RoHS: Yes; Case/Package: 0402; ComponentLink2URL: https://jlcpcb.com/partdetail/C15525; Manufacturer Part Number: CL05A106MQ5NUNC; Design Item ID: CL05A106MQ5NUNC; Source: jlcpcb_capacitors_basic.schlib; Category: Capacitors - MLCC; ComponentLink3URL: https://lcsc.com/product-detail/Multilayer-Ceramic-Capacitors-MLCC---SMD-SMT_Samsung-Electro-Mechanics-Samsung-Electro-Mechanics-CL05A106MQ5NUNC_C15525.html; JLCPCB Basic Part: Yes
C2 C4 C5 = CMP-001-00140-3: as C28 on sheet SCH - Compute, Flash; Case/Package: 0402; ComponentLink2Description: JLCPCB Part URL; Manufacturer Part Number: CL05A105KA5NQNC; RoHS: Yes; Temperature Coefficient: X5R; Tolerance: 10%; ComponentLink2URL: https://jlcpcb.com/partdetail/C52923; ComponentLink1URL: https://datasheet.lcsc.com/lcsc/1811091611_Samsung-Electro-Mechanics-CL05A105KA5NQNC_C52923.pdf; ComponentLink3URL: https://lcsc.com/product-detail/Multilayer-Ceramic-Capacitors-MLCC---SMD-SMT_Samsung-Electro-Mechanics-Samsung-Electro-Mechanics-CL05A105KA5NQNC_C52923.html; ComponentLink1Description: Datasheet; ComponentLink3Description: LCSC Part URL; JLCPCB Basic Part: Yes; Design Item ID: CL05A105KA5NQNC; JLCPCB Part Number: C52923; Source: jlcpcb_capacitors_basic.schlib; Category: Capacitors - MLCC; Voltage Rating: 25V
C3 = CMP-001-00146-3: as C29 on sheet SCH - Compute, Flash; Source: jlcpcb_capacitors_basic.schlib; ComponentLink2URL: https://jlcpcb.com/partdetail/C307331; JLCPCB Part Number: C307331; JLCPCB Basic Part: Yes; Voltage Rating: 50V; Manufacturer Part Number: CL05B104KB54PNC; RoHS: Yes; Case/Package: 0402; Temperature Coefficient: X7R; ComponentLink1URL: https://datasheet.lcsc.com/lcsc/1810191222_Samsung-Electro-Mechanics-CL05B104KB54PNC_C307331.pdf; Category: Capacitors - MLCC; ComponentLink2Description: JLCPCB Part URL; ComponentLink3Description: LCSC Part URL; Design Item ID: CL05B104KB54PNC; ComponentLink3URL: https://lcsc.com/product-detail/Multilayer-Ceramic-Capacitors-MLCC---SMD-SMT_Samsung-Electro-Mechanics-Samsung-Electro-Mechanics-CL05B104KB54PNC_C307331.html; ComponentLink1Description: Datasheet; Tolerance: 10%
C6 = CMP-001-00142-3: Capacitor, Ceramic (MLCC), 2.2uF, ±20%, 6.3V, X5R, ±20%, SMD 0402; Manufacturer: Samsung Electro-Mechanics; Category: Capacitors - MLCC; Case/Package: 0402; ComponentLink1URL: https://datasheet.lcsc.com/lcsc/1811021410_Samsung-Electro-Mechanics-CL05A225MQ5NSNC_C12530.pdf; Temperature Coefficient: X5R; Tolerance: 20%; Design Item ID: CL05A225MQ5NSNC; JLCPCB Part Number: C12530; Voltage Rating: 6.3V; ComponentLink1Description: Datasheet; ComponentLink2URL: https://jlcpcb.com/partdetail/C12530; Source: jlcpcb_capacitors_basic.schlib; Manufacturer Part Number: CL05A225MQ5NSNC; RoHS: Yes; ComponentLink2Description: JLCPCB Part URL; ComponentLink3Description: LCSC Part URL; JLCPCB Basic Part: Yes; ComponentLink3URL: https://lcsc.com/product-detail/Multilayer-Ceramic-Capacitors-MLCC---SMD-SMT_Samsung-Electro-Mechanics-Samsung-Electro-Mechanics-CL05A225MQ5NSNC_C12530.html
D1 = NCD0805R1: 0805 Red LED | 25mA | Vf = 1.6-2.6V - 20mA 67mcd~195mcd -30℃~+85℃ 615nm~630nm Red 130° 65mW 1.6V~2.6V 0805 Light Emitting Diodes (LED) ROHS; MF: Foshan NationStar Optoelectronics; Package: 0805; MP: NCD0805R1; Check_prices: https://www.snapeda.com/parts/KT-0805W/Hubei+KENTO+Elec/view-part/?ref=eda; LCSC Part #: C84256; JLCPCB Part #: C84256; JLCPCB Part Number: C84256
D2 = KT-0805W: 0805 WHT LED | 25mA | Vf = 2.6-3.2V - 0805 Light Emitting Diodes (LED) ROHS; MF: Hubei KENTO Elec; SnapEDA_Link: https://www.snapeda.com/parts/KT-0805W/Hubei+KENTO+Elec/view-part/?ref=snap; Package: 0805; MP: KT-0805W; LCSC Part #: C34499; JLCPCB Part #: C34499; JLCPCB Part Number: C34499
F1-F3 = Fiducial: 1x2mm Fiducial Pad; ClassName: Fiducial; Component Class name: Fiducial
P1 = CMP-045-000000-8: USB - micro B USB 2.0 Receptacle Connector 5 Position Surface Mount, Right Angle; Through Hole; MF: Amphenol ICC; MP: 10118193-0001LF; Component Type: Standard; Design Item ID: 10118193-0001LF; Pin Count: 11; Package: None; Source: SnapEDAsch.SchLib; SnapEDA_Link: https://www.snapeda.com/parts/10118193-0001LF/Amphenol%20FCI/view-part/2758989/?ref=snap; JLCPCB Part Number: C132562
P2 = HDR2X20: Header, 20-Pin, Dual row, 2.54mm Pin Pitch; Signal Integrity: Connector; LatestRevisionNote: Re-released for DXP Platform.; Publisher: Altium Limited; Pin Count: 40; Source: Miscellaneous Connectors.SchLib; Design Item ID: Header 20X2; Component Type: Standard; LatestRevisionDate: 17-Jul-2002
P3 = CMP-005-0002-2: Header 1.27mm pitch, 2x5, PTH through hole; Pins: 10; element14 Item: 1577743; Design Item ID: Header 1.27mm 2x5 PTH; Source: JCULibrary.SchLib; Component Type: Standard
P4 = CMP-002-00124-1: Header, 4-Pin; Signal Integrity: Connector; LatestRevisionNote: Re-released for DXP Platform.; Component Type: Standard; Design Item ID: Header 4; Source: Miscellaneous Connectors.SchLib; Pin Count: 4; Publisher: Altium Limited; LatestRevisionDate: 17-Jul-2002
P5 = CMP-002-00117-1: Header, 3-Pin; Signal Integrity: Connector; Design Item ID: Header 3; LatestRevisionDate: 17-Jul-2002; Publisher: Altium Limited; Component Type: Standard; Pin Count: 3; Source: Miscellaneous Connectors.SchLib; LatestRevisionNote: Re-released for DXP Platform.
P6 = B4B-XH-A: JST 4 Pin Single Row Header | Top Facing | AWG 22-30 | 3A 250VAC | 10-20mOhm contact impedance | Connector Header Through Hole 4 position 0.098 (2.50mm); MF: JST Sales; MP: B4B-XH-A(LF)(SN); SnapEDA_Link: https://www.snapeda.com/parts/B4B-XH-A(LF)(SN)/JST+Sales+America+Inc./view-part/?ref=snap; Package: None; Value: *; Check_prices: https://www.snapeda.com/parts/B4B-XH-A(LF)(SN)/JST+Sales+America+Inc./view-part/?ref=eda
R1 R3 = CMP-009-00178-4: Resistor, 0Ω, ±1%, 62.5mW, 50V, ±800ppm/℃, -55℃~+155℃, SMD 0402; Manufacturer: Uniroyal; ComponentLink1URL: https://datasheet.lcsc.com/lcsc/2206010216_UNI-ROYAL-Uniroyal-Elec-0402WGF0000TCE_C17168.pdf; JLCPCB Part Number: C17168; Design Item ID: 0402WGF0000TCE; Temperature Coefficient: ±800ppm/℃; Voltage Rating: 50V; Temperature Rating: -55℃~+155℃; Category: Resistors; Case/Package: 0402; JLCPCB Basic Part: Yes; Manufacturer Part Number: 0402WGF0000TCE; ComponentLink2Description: JLCPCB Part URL; Source: jlcpcb_resistors_basic.schlib; Tolerance: 1%; ComponentLink1Description: Datasheet; Power Rating: 62.5mW; ComponentLink2URL: https://jlcpcb.com/partdetail/C17168
R2 R4-R6 R9 = CMP-009-00181-4: as R29 on sheet SCH - Compute, Flash; Category: Resistors; JLCPCB Part Number: C25744; ComponentLink1Description: Datasheet; ComponentLink2URL: https://jlcpcb.com/partdetail/C25744; Tolerance: 1%; ComponentLink2Description: JLCPCB Part URL; Power Rating: 62.5mW; Manufacturer Part Number: 0402WGF1002TCE; Voltage Rating: 50V; Temperature Rating: -55℃~+155℃; JLCPCB Basic Part: Yes; ComponentLink1URL: https://datasheet.lcsc.com/lcsc/2206010100_UNI-ROYAL-Uniroyal-Elec-0402WGF1002TCE_C25744.pdf; Source: jlcpcb_resistors_basic.schlib; Design Item ID: 0402WGF1002TCE; Case/Package: 0402; Temperature Coefficient: ±100ppm/℃
R7 R8 R10 = CMP-009-00186-4: Resistor, 1Ω, ±1%, 62.5mW, 50V, ±200ppm/℃, -55℃~+155℃, SMD 0402; Manufacturer: Uniroyal; ComponentLink1URL: https://datasheet.lcsc.com/lcsc/2205311900_UNI-ROYAL-Uniroyal-Elec-0402WGF100KTCE_C25086.pdf; Source: jlcpcb_resistors_basic.schlib; Temperature Rating: -55℃~+155℃; Power Rating: 62.5mW; JLCPCB Basic Part: Yes; ComponentLink2Description: JLCPCB Part URL; Manufacturer Part Number: 0402WGF100KTCE; Category: Resistors; Tolerance: 1%; ComponentLink2URL: https://jlcpcb.com/partdetail/C25086; ComponentLink1Description: Datasheet; Voltage Rating: 50V; Case/Package: 0402; Design Item ID: 0402WGF100KTCE; Temperature Coefficient: ±200ppm/℃; JLCPCB Part Number: C25086
R11 = CMP-009-00210-4: Resistor, 330Ω, ±1%, 62.5mW, 50V, ±100ppm/℃, -55℃~+155℃, SMD 0402; Manufacturer: Uniroyal; Source: jlcpcb_resistors_basic.schlib; Temperature Rating: -55℃~+155℃; Voltage Rating: 50V; Temperature Coefficient: ±100ppm/℃; Power Rating: 62.5mW; Category: Resistors; ComponentLink2URL: https://jlcpcb.com/partdetail/C25104; Tolerance: 1%; ComponentLink1URL: https://datasheet.lcsc.com/lcsc/2205311900_UNI-ROYAL-Uniroyal-Elec-0402WGF3300TCE_C25104.pdf; Design Item ID: 0402WGF3300TCE; JLCPCB Part Number: C25104; Case/Package: 0402; JLCPCB Basic Part: Yes; ComponentLink1Description: Datasheet; Manufacturer Part Number: 0402WGF3300TCE; ComponentLink2Description: JLCPCB Part URL
R12 = CMP-009-00231-4: Resistor, 680Ω, ±1%, 62.5mW, 50V, ±100ppm/℃, -55℃~+155℃, SMD 0402; Manufacturer: Uniroyal; Temperature Rating: -55℃~+155℃; ComponentLink2URL: https://jlcpcb.com/partdetail/C25130; Source: jlcpcb_resistors_basic.schlib; Voltage Rating: 50V; ComponentLink1URL: https://datasheet.lcsc.com/lcsc/2205311900_UNI-ROYAL-Uniroyal-Elec-0402WGF6800TCE_C25130.pdf; ComponentLink2Description: JLCPCB Part URL; ComponentLink1Description: Datasheet; Case/Package: 0402; Design Item ID: 0402WGF6800TCE; Manufacturer Part Number: 0402WGF6800TCE; Temperature Coefficient: ±100ppm/℃; Power Rating: 62.5mW; JLCPCB Basic Part: Yes; Tolerance: 1%; JLCPCB Part Number: C25130; Category: Resistors
T1-T9 = TestPoint
U1 = TLV7163318PDPQR: Texas Instruments - TLV7163318PDPQR / 150mA Fixed Positive electrode 5.5V X2SON-6(1.2x1.2) Voltage Regulators - Linear, Low Drop Out (LDO) Regulators ROHS; JLCPCB Part Number: C2859836
U2 = INA3221AIRGVR: Texas Instruments INA3221AIRGVR - QFN-16-EP(4x4) Current Sense Amplifiers ROHS; Manufacturer: TI(德州仪器); Add into BOM: yes; Symbol: INA3221AIRGVR; Device: INA3221AIRGVR; LCSC Part Name: INA3221AIRGVR; Manufacturer Part: INA3221AIRGVR; Supplier Footprint: QFN-16-EP(4x4); JLCPCB Part Class: Extended Part; Datasheet: https://www.ti.com/cn/lit/gpn/ina3221; Supplier: LCSC; Convert to PCB: yes; JLCPCB Part Number: C181255